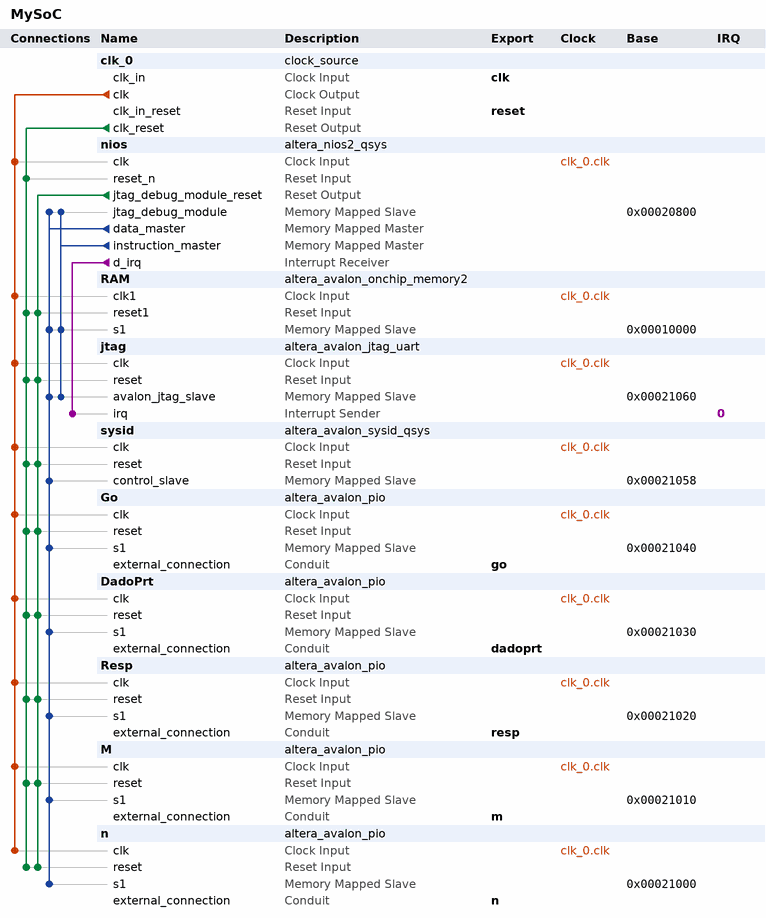
[diagram p0: system contents]
# Platform Designer (Qsys) system MySoC, Cyclone III EP3C25F324C6
# Parameters at their usual value, and those the tool derives, are not listed.
package require -exact qsys 13.0.1.99.2
create_system MySoC
set_project_property DEVICE_FAMILY {Cyclone III}
set_project_property DEVICE EP3C25F324C6

add_instance clk_0 clock_source 13.0
set_instance_parameter_value clk_0 clockFrequency 50000000

add_instance nios altera_nios2_qsys 13.0
set_instance_parameter_value nios resetSlave RAM.s1
set_instance_parameter_value nios mmu_TLBMissExcSlave None
set_instance_parameter_value nios exceptionSlave RAM.s1
set_instance_parameter_value nios breakSlave nios.jtag_debug_module
set_instance_parameter_value nios impl Tiny
set_instance_parameter_value nios icache_size 4096

add_instance RAM altera_avalon_onchip_memory2 13.0.1.99.2
set_instance_parameter_value RAM dataWidth 32
set_instance_parameter_value RAM dualPort false
set_instance_parameter_value RAM initMemContent true
set_instance_parameter_value RAM initializationFileName onchip_mem.hex
set_instance_parameter_value RAM memorySize 40960

add_instance jtag altera_avalon_jtag_uart 13.0.1.99.2
set_instance_parameter_value jtag simInteractiveOptions NO_INTERACTIVE_WINDOWS

add_instance sysid altera_avalon_sysid_qsys 13.0
set_instance_parameter_value sysid id 0

add_instance Go altera_avalon_pio 13.0.1.99.2
set_instance_parameter_value Go direction Output
set_instance_parameter_value Go width 1

add_instance DadoPrt altera_avalon_pio 13.0.1.99.2
set_instance_parameter_value DadoPrt direction Input
set_instance_parameter_value DadoPrt width 1

add_instance Resp altera_avalon_pio 13.0.1.99.2
set_instance_parameter_value Resp direction Input
set_instance_parameter_value Resp width 12

add_instance M altera_avalon_pio 13.0.1.99.2
set_instance_parameter_value M direction Output
set_instance_parameter_value M width 6

add_instance n altera_avalon_pio 13.0.1.99.2
set_instance_parameter_value n direction Output
set_instance_parameter_value n width 6

# connections
add_connection clk_0.clk DadoPrt.clk clock
add_connection clk_0.clk Go.clk clock
add_connection clk_0.clk jtag.clk clock
add_connection clk_0.clk M.clk clock
add_connection clk_0.clk n.clk clock
add_connection clk_0.clk nios.clk clock
add_connection clk_0.clk RAM.clk1 clock
add_connection clk_0.clk Resp.clk clock
add_connection clk_0.clk sysid.clk clock
add_connection clk_0.clk_reset DadoPrt.reset reset
add_connection clk_0.clk_reset Go.reset reset
add_connection clk_0.clk_reset jtag.reset reset
add_connection clk_0.clk_reset M.reset reset
add_connection clk_0.clk_reset n.reset reset
add_connection clk_0.clk_reset nios.reset_n reset
add_connection clk_0.clk_reset RAM.reset1 reset
add_connection clk_0.clk_reset Resp.reset reset
add_connection clk_0.clk_reset sysid.reset reset
add_connection nios.jtag_debug_module_reset DadoPrt.reset reset
add_connection nios.jtag_debug_module_reset Go.reset reset
add_connection nios.jtag_debug_module_reset jtag.reset reset
add_connection nios.jtag_debug_module_reset M.reset reset
add_connection nios.jtag_debug_module_reset n.reset reset
add_connection nios.jtag_debug_module_reset RAM.reset1 reset
add_connection nios.jtag_debug_module_reset Resp.reset reset
add_connection nios.jtag_debug_module_reset sysid.reset reset
add_connection nios.data_master DadoPrt.s1 avalon
set_connection_parameter_value nios.data_master/DadoPrt.s1 baseAddress 0x00021030
add_connection nios.data_master Go.s1 avalon
set_connection_parameter_value nios.data_master/Go.s1 baseAddress 0x00021040
add_connection nios.data_master jtag.avalon_jtag_slave avalon
set_connection_parameter_value nios.data_master/jtag.avalon_jtag_slave baseAddress 0x00021060
add_connection nios.data_master M.s1 avalon
set_connection_parameter_value nios.data_master/M.s1 baseAddress 0x00021010
add_connection nios.data_master n.s1 avalon
set_connection_parameter_value nios.data_master/n.s1 baseAddress 0x00021000
add_connection nios.data_master nios.jtag_debug_module avalon
set_connection_parameter_value nios.data_master/nios.jtag_debug_module baseAddress 0x00020800
add_connection nios.data_master RAM.s1 avalon
set_connection_parameter_value nios.data_master/RAM.s1 baseAddress 0x00010000
add_connection nios.data_master Resp.s1 avalon
set_connection_parameter_value nios.data_master/Resp.s1 baseAddress 0x00021020
add_connection nios.data_master sysid.control_slave avalon
set_connection_parameter_value nios.data_master/sysid.control_slave baseAddress 0x00021058
add_connection nios.instruction_master jtag.avalon_jtag_slave avalon
set_connection_parameter_value nios.instruction_master/jtag.avalon_jtag_slave baseAddress 0x00021060
add_connection nios.instruction_master nios.jtag_debug_module avalon
set_connection_parameter_value nios.instruction_master/nios.jtag_debug_module baseAddress 0x00020800
add_connection nios.instruction_master RAM.s1 avalon
set_connection_parameter_value nios.instruction_master/RAM.s1 baseAddress 0x00010000
add_connection nios.d_irq jtag.irq interrupt
set_connection_parameter_value nios.d_irq/jtag.irq irqNumber 0

# exported interfaces
add_interface clk clock sink
set_interface_property clk EXPORT_OF clk_0.clk_in
add_interface reset reset sink
set_interface_property reset EXPORT_OF clk_0.clk_in_reset
add_interface dadoprt conduit end
set_interface_property dadoprt EXPORT_OF DadoPrt.external_connection
add_interface go conduit end
set_interface_property go EXPORT_OF Go.external_connection
add_interface resp conduit end
set_interface_property resp EXPORT_OF Resp.external_connection
add_interface m conduit end
set_interface_property m EXPORT_OF M.external_connection
add_interface n conduit end
set_interface_property n EXPORT_OF n.external_connection

set_interconnect_requirement {$system} qsys_mm.clockCrossingAdapter HANDSHAKE
set_interconnect_requirement {$system} qsys_mm.maxAdditionalLatency 1

save_system MySoC.qsys
